# EasyEDA schematic 1-Schematic_Logic.json
TITLE: Sheet_1; REV: 1.0; Date: 2025-12-05; Sheet: 1/1; Drawn By: abdulrahmane014; Company: Your Company
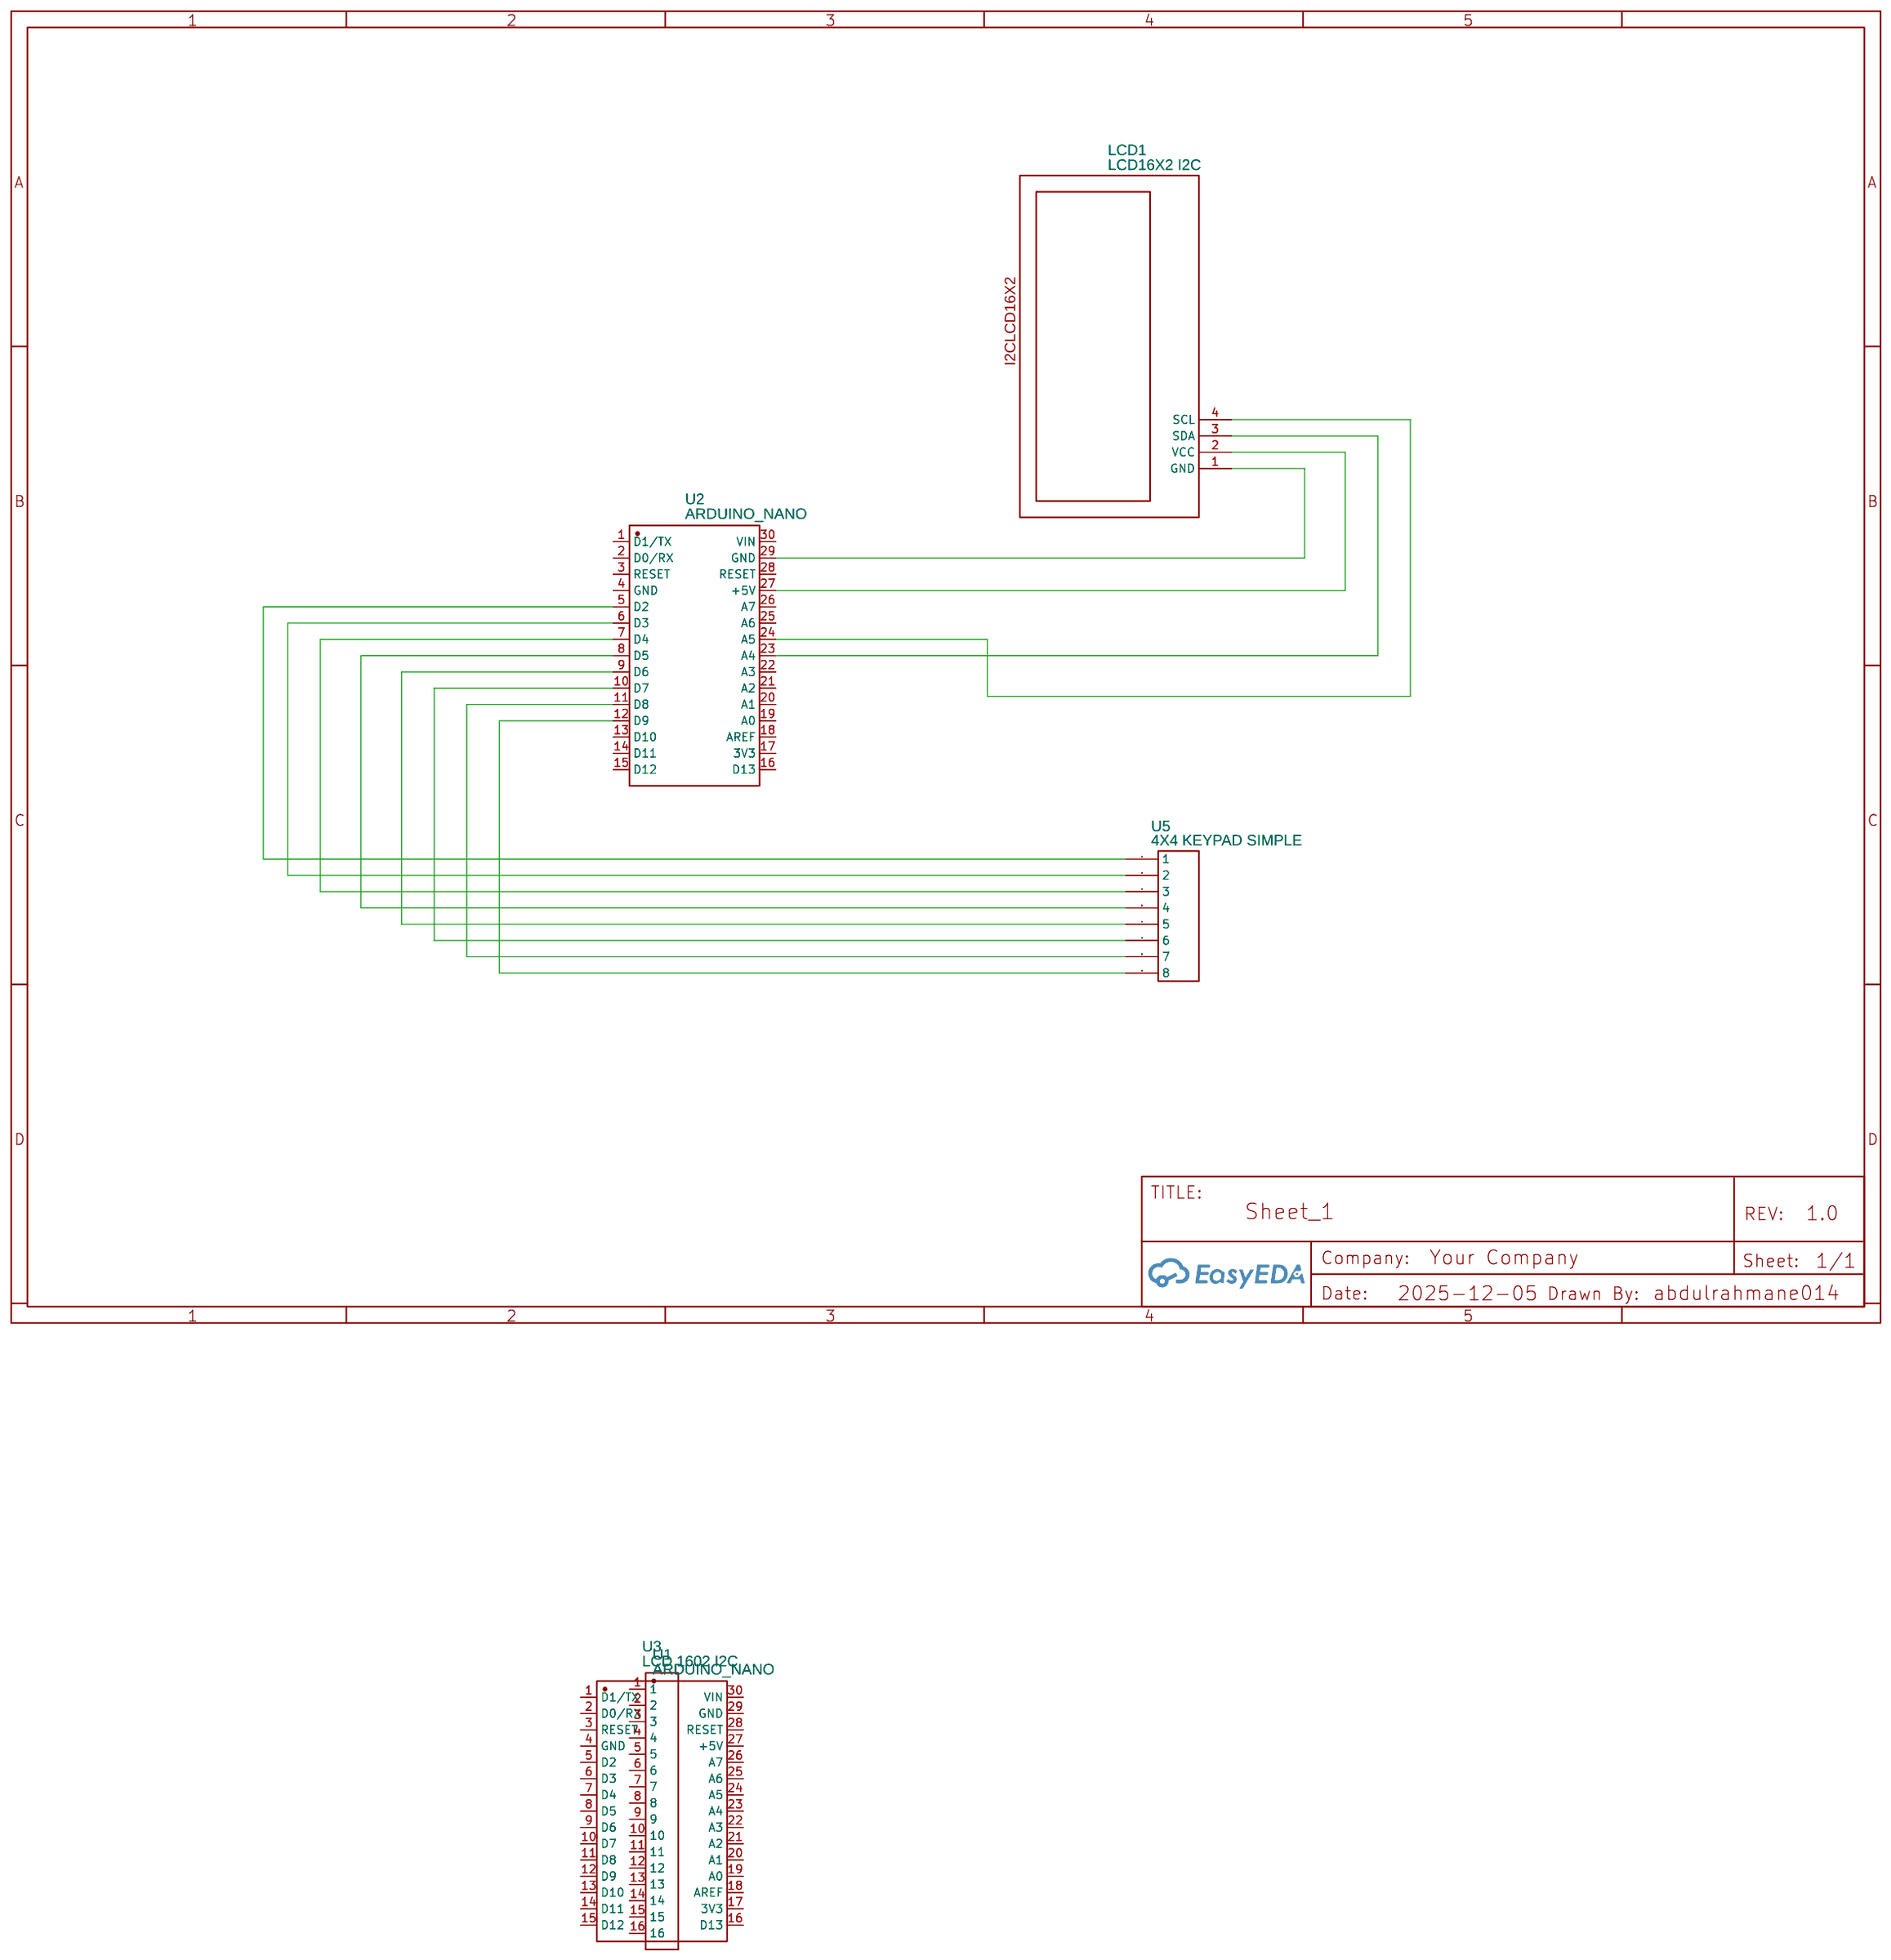
[diagram p0: schematic sheet]

## Parts
LCD1  LCD16X2 I2C  [I2CLCD16X2]
U1  ARDUINO_NANO  [COMM-TH_ARDUINO_NANO]
U2  ARDUINO_NANO  [COMM-TH_ARDUINO_NANO]
U3  LCD 1602 I2C  [LCD-TH_LCD-1602-2X16-BLUE-WHITE]
U5  4X4 KEYPAD SIMPLE  [KEYPAD 4X4 (KEYPAD 4*4)]

## Library data of the parts
LCD1 = LCD16X2 I2C: Contributor: hobbyelectronix
U1 U2 = ARDUINO_NANO: Contributor: lcsc; Supplier: LCSC; Supplier Part: C9900017879; Manufacturer: null; JLCPCB Part Class: Extended Part
U3 = LCD 1602 I2C: Supplier: LCSC; Supplier Part: C9900187671; Manufacturer: null; JLCPCB Part Class: Extended Part; Contributor: lcsc
U5 = 4X4 KEYPAD SIMPLE: Contributor: arkanoor09

## Nets
Net-(LCD1-1): LCD1.1(GND) U2.29(GND)
Net-(LCD1-2): LCD1.2(VCC) U2.27(+5V)
Net-(LCD1-3): LCD1.3(SDA) U2.23(A4)
Net-(LCD1-4): LCD1.4(SCL) U2.24(A5)
Net-(U2-5): U2.5(D2) U5.3(1)
Net-(U2-6): U2.6(D3) U5.4(2)
Net-(U2-7): U2.7(D4) U5.5(3)
Net-(U2-8): U2.8(D5) U5.6(4)
Net-(U2-9): U2.9(D6) U5.7(5)
Net-(U2-10): U2.10(D7) U5.8(6)
Net-(U2-11): U2.11(D8) U5.9(7)
Net-(U2-12): U2.12(D9) U5.10(8)

Not connected (* = marked no-connect by the designer): U1 1(D1/TX) 2(D0/RX) 3(RESET) 4(GND) 5(D2) 6(D3) 7(D4) 8(D5) 9(D6) 10(D7) 11(D8) 12(D9) 13(D10) 14(D11) 15(D12) 16(D13) 17(3V3) 18(AREF) 19(A0) 20(A1) 21(A2) 22(A3) 23(A4) 24(A5) 25(A6) 26(A7) 27(+5V) 28(RESET) 29(GND) 30(VIN); U2 1(D1/TX) 2(D0/RX) 3(RESET) 4(GND) 13(D10) 14(D11) 15(D12) 16(D13) 17(3V3) 18(AREF) 19(A0) 20(A1) 21(A2) 22(A3) 25(A6) 26(A7) 28(RESET) 30(VIN); U3 1 2 3 4 5 6 7 8 9 10 11 12 13 14 15 16
